# Altium schematic sheet can connector.SchDoc
size A4
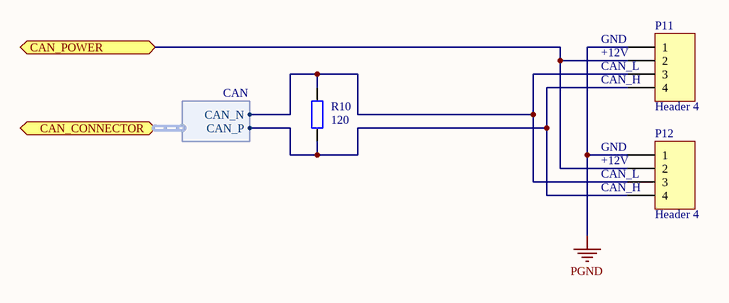
[diagram p0: can connector.SchDoc]

## Parts
P11  Header 4  [B04B-PASK-1]
P12  Header 4  [B04B-PASK-1]
R10  value 120  [R0603]  (hidden comment: Res2)

## Ports
CAN_CONNECTOR (harness CAN), CAN_POWER

## Harnesses
CAN: CAN_N, CAN_P

## Nets
PGND: P11.1 P12.1
CAN_POWER: P11.2 P12.2 ; port CAN_POWER
NetP11_3: P11.3 P12.3 R10.2 ; port CAN_CONNECTOR.CAN_N
NetP11_4: P11.4 P12.4 R10.1 ; port CAN_CONNECTOR.CAN_P

## Notes on the sheet
- (near P11) GND
- (near P11) +12V
- (near P11) CAN_L
- (near P11) CAN_H
- (near P12) GND
- (near P12) +12V
- (near P12) CAN_L
- (near P12) CAN_H

## Library data of the parts
P11 P12 = Header 4: Header, 4-Pin; LatestRevisionDate: 17-Jul-2002; LatestRevisionNote: Re-released for DXP Platform.; Publisher: Altium Limited; farnell: 1830749
R10 = Res2: Resistor; Published: 8-Jun-2000; LatestRevisionDate: 17-Jul-2002; LatestRevisionNote: Re-released for DXP Platform.; PackageReference: AXIAL-0.4; Publisher: Altium Limited; farnell: 9330496